# Altium schematic sheet 11.SchDoc
size 635 x 406 mm
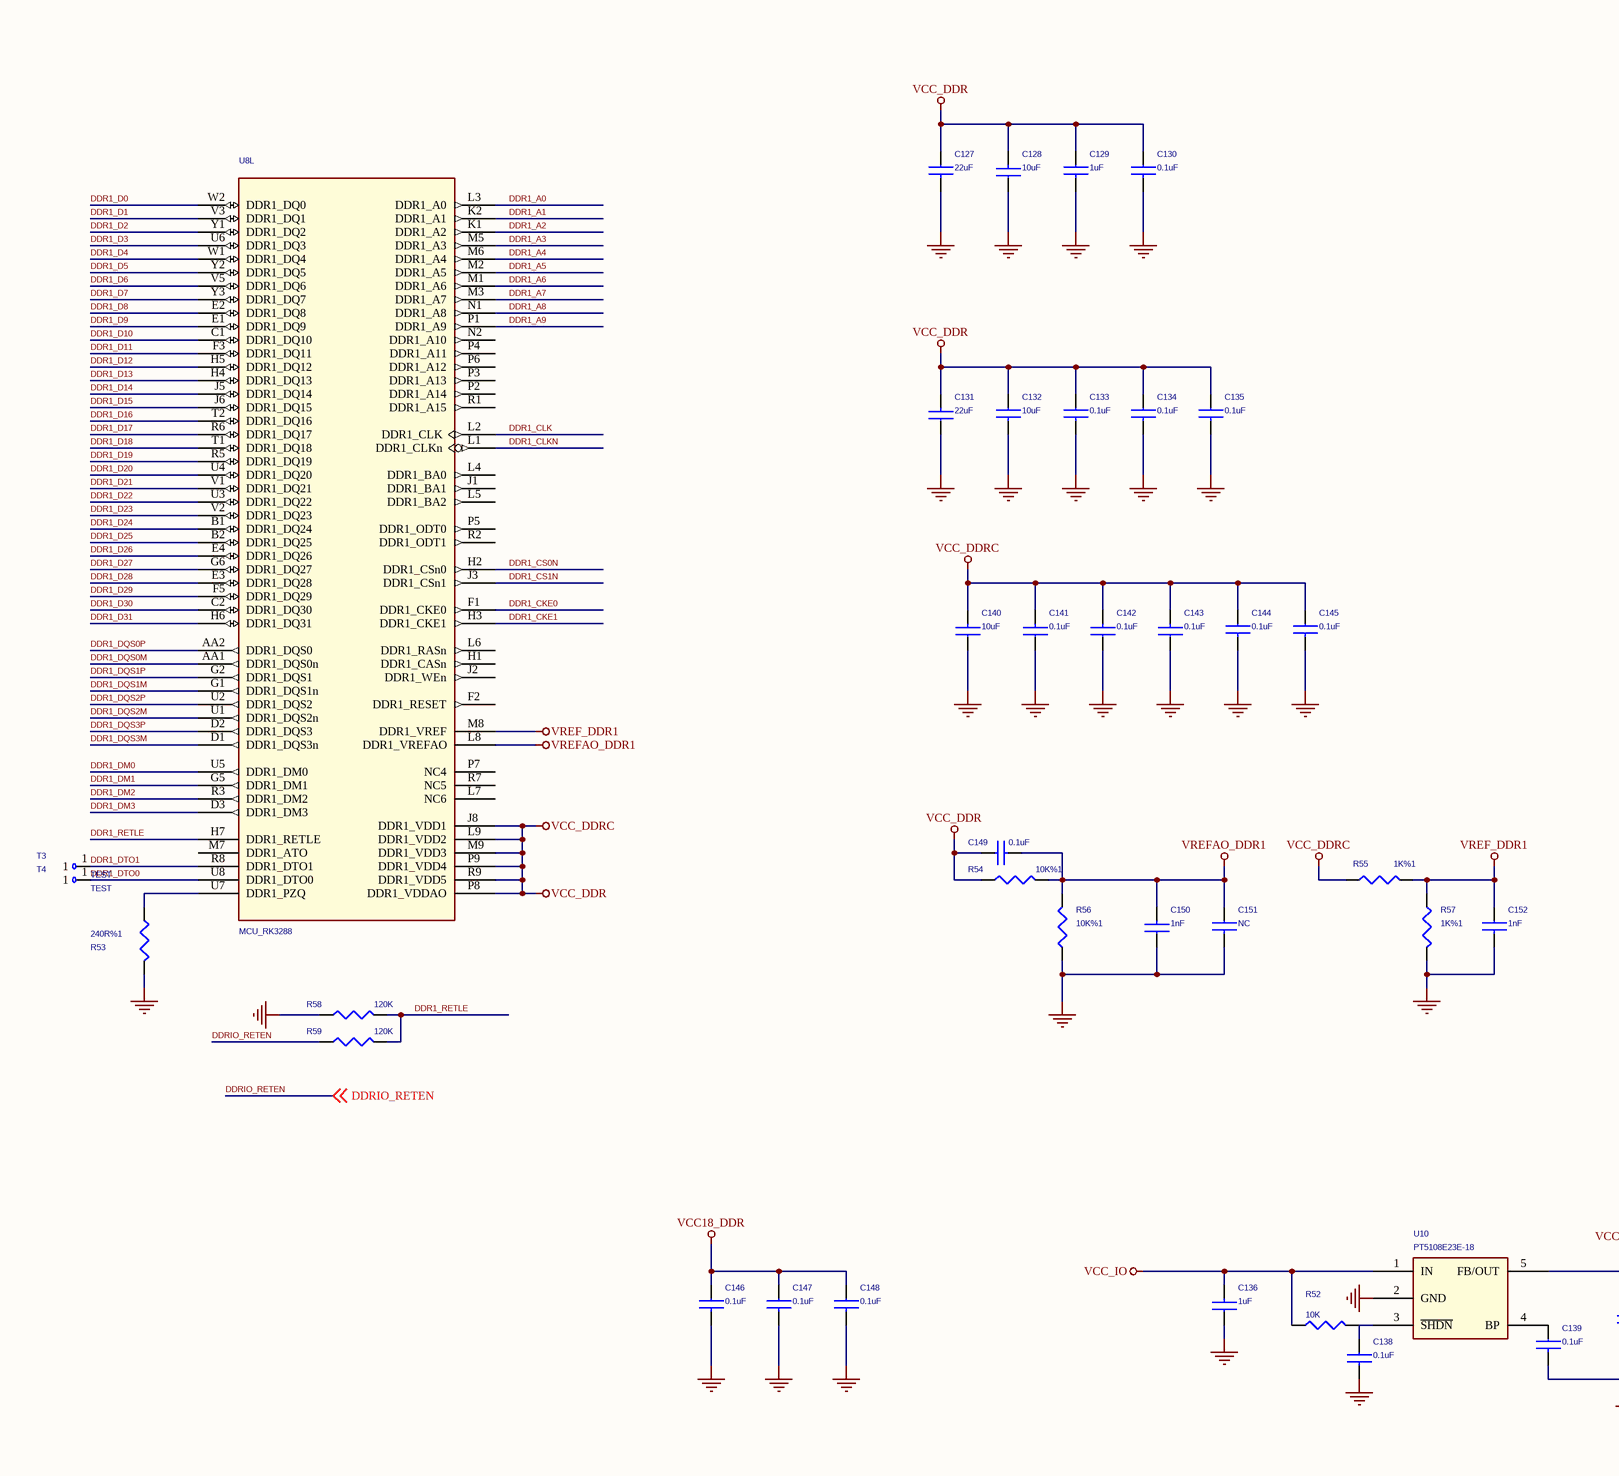
[diagram p0: 11.SchDoc, left]
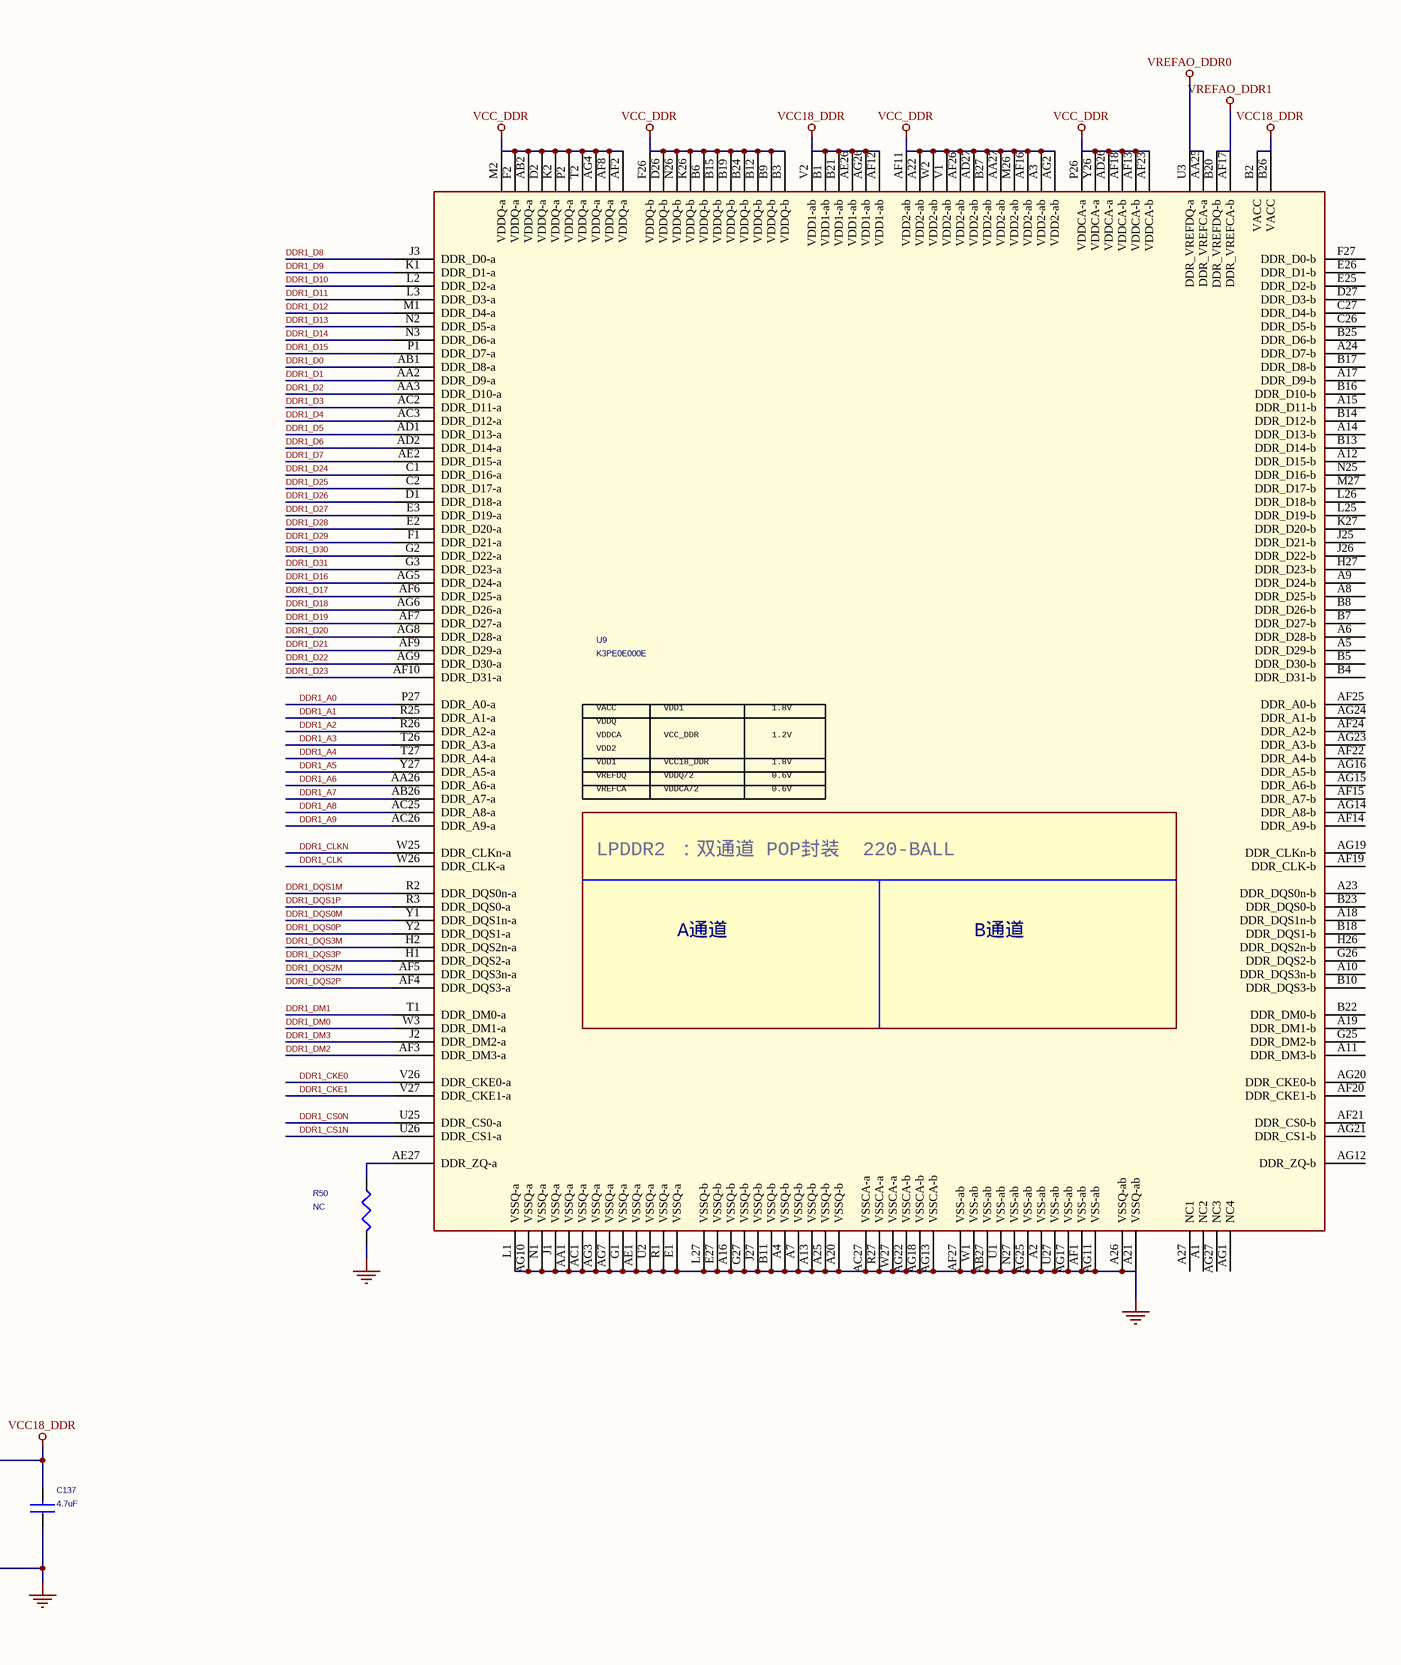
[diagram p1: 11.SchDoc, right]

## Parts
C127  22uF  [C0805]
C128  10uF  [C0603]
C129  1uF  [c0402]
C130  0.1uF  [c0402]
C131  22uF  [C0805]
C132  10uF  [C0603]
C133  0.1uF  [c0402]
C134  0.1uF  [c0402]
C135  0.1uF  [C0201]
C136  1uF  [c0402]
C137  4.7uF  [C0603]
C138  0.1uF  [c0402]
C139  0.1uF  [c0402]
C140  10uF  [C0603]
C141  0.1uF  [c0402]
C142  0.1uF  [c0402]
C143  0.1uF  [c0402]
C144  0.1uF  [c0402]
C145  0.1uF  [c0402]
C146  0.1uF  [c0402]
C147  0.1uF  [c0402]
C148  0.1uF  [C0201]
C149  0.1uF  [c0402]
C150  1nF  [C0201]
C151  NC  [c0402]
C152  1nF  [c0402]
R50  NC  [r0402]
R52  10K  [r0402]
R53  240R%1  [r0402]
R54  10K%1  [r0402]
R55  1K%1  [r0402]
R56  10K%1  [r0402]
R57  1K%1  [r0402]
R58  120K  [r0402]
R59  120K  [r0402]
T3  TEST  [TEST]
T4  TEST  [TEST]
U8  MCU_RK3288  [BGA453-19X19]  (part L of 24)
U9  K3PE0E000E  [FBGA220-14X14]
U10  PT5108E23E-18  [SOT25]

## Nets
GND: C127.2 C128.1 C129.2 C130.2 C131.1 C132.2 C133.2 C134.2 C135.2 C136.1 C137.1 C138.2 C139.2 C140.1 C141.1 C142.1 C143.1 C144.2 C145.2 C146.2 C147.2 C148.2 C150.1 C151.2 C152.2 R50.2 R53.2 R56.1 R57.2 R58.2 U9.A2(VSS-ab) U9.A4(VSSQ-b) U9.A7(VSSQ-b) U9.A13(VSSQ-b) U9.A16(VSSQ-b) U9.A20(VSSQ-b) U9.A21(VSSQ-ab) U9.A25(VSSQ-b) U9.A26(VSSQ-ab) U9.AA1(VSSQ-a) U9.AB27(VSS-ab) U9.AC1(VSSQ-a) U9.AC27(VSSCA-a) U9.AE1(VSSQ-a) U9.AF1(VSS-ab) U9.AF27(VSS-ab) U9.AG3(VSSQ-a) U9.AG7(VSSQ-a) U9.AG10(VSSQ-a) U9.AG11(VSS-ab) U9.AG13(VSSCA-b) U9.AG17(VSS-ab) U9.AG18(VSSCA-b) U9.AG22(VSSCA-b) U9.AG25(VSS-ab) U9.B11(VSSQ-b) U9.E1(VSSQ-a) U9.E27(VSSQ-b) U9.G1(VSSQ-a) U9.G27(VSSQ-b) U9.J1(VSSQ-a) U9.J27(VSSQ-b) U9.L1(VSSQ-a) U9.L27(VSSQ-b) U9.N1(VSSQ-a) U9.N27(VSS-ab) U9.R1(VSSQ-a) U9.R27(VSSCA-a) U9.U1(VSS-ab) U9.U2(VSSQ-a) U9.U27(VSS-ab) U9.W1(VSS-ab) U9.W27(VSSCA-a) U10.2(GND)
VCC18_DDR: C137.2 C146.1 C147.1 C148.1 U9.AE26(VDD1-ab) U9.AF12(VDD1-ab) U9.AG26(VDD1-ab) U9.B1(VDD1-ab) U9.B2(VACC) U9.B21(VDD1-ab) U9.B26(VACC) U9.V2(VDD1-ab) U10.5(FB/OUT)
VCC_DDR: C127.1 C128.2 C129.1 C130.1 C131.2 C132.1 C133.1 C134.1 C135.1 C140.2 C141.2 C142.2 C143.2 C144.1 C145.1 C149.1 R54.1 R55.1 U8.J8(DDR1_VDD1) U8.L9(DDR1_VDD2) U8.M9(DDR1_VDD3) U8.P8(DDR1_VDDAO) U8.P9(DDR1_VDD4) U8.R9(DDR1_VDD5) U9.A3(VDD2-ab) U9.A22(VDD2-ab) U9.AA27(VDD2-ab) U9.AB2(VDDQ-a) U9.AD26(VDDCA-a) U9.AD27(VDD2-ab) U9.AF2(VDDQ-a) U9.AF8(VDDQ-a) U9.AF11(VDD2-ab) U9.AF13(VDDCA-b) U9.AF16(VDD2-ab) U9.AF18(VDDCA-b) U9.AF23(VDDCA-b) U9.AF26(VDD2-ab) U9.AG2(VDD2-ab) U9.AG4(VDDQ-a) U9.B3(VDDQ-b) U9.B6(VDDQ-b) U9.B9(VDDQ-b) U9.B12(VDDQ-b) U9.B15(VDDQ-b) U9.B19(VDDQ-b) U9.B24(VDDQ-b) U9.B27(VDD2-ab) U9.D2(VDDQ-a) U9.D26(VDDQ-b) U9.F2(VDDQ-a) U9.F26(VDDQ-b) U9.K2(VDDQ-a) U9.K26(VDDQ-b) U9.M2(VDDQ-a) U9.M26(VDD2-ab) U9.N26(VDDQ-b) U9.P2(VDDQ-a) U9.P26(VDDCA-a) U9.T2(VDDQ-a) U9.V1(VDD2-ab) U9.W2(VDD2-ab) U9.Y26(VDDCA-a)  [also labelled VCC_DDRC]
VCC_IO: C136.2 R52.1 U10.1(IN)
VREF_DDR1: C152.1 R55.2 R57.1 U8.M8(DDR1_VREF)
VREFAO_DDR0: U9.AA25(DDR_VREFCA-a) U9.U3(DDR_VREFDQ-a)
VREFAO_DDR1: C149.2 C150.2 C151.1 R54.2 R56.2 U8.L8(DDR1_VREFAO) U9.AF17(DDR_VREFCA-b) U9.B20(DDR_VREFDQ-b)
DDR1_A0: U8.L3(DDR1_A0) U9.P27(DDR_A0-a)
DDR1_A1: U8.K2(DDR1_A1) U9.R25(DDR_A1-a)
DDR1_A2: U8.K1(DDR1_A2) U9.R26(DDR_A2-a)
DDR1_A3: U8.M5(DDR1_A3) U9.T26(DDR_A3-a)
DDR1_A4: U8.M6(DDR1_A4) U9.T27(DDR_A4-a)
DDR1_A5: U8.M2(DDR1_A5) U9.Y27(DDR_A5-a)
DDR1_A6: U8.M1(DDR1_A6) U9.AA26(DDR_A6-a)
DDR1_A7: U8.M3(DDR1_A7) U9.AB26(DDR_A7-a)
DDR1_A8: U8.N1(DDR1_A8) U9.AC25(DDR_A8-a)
DDR1_A9: U8.P1(DDR1_A9) U9.AC26(DDR_A9-a)
DDR1_CKE0: U8.F1(DDR1_CKE0) U9.V26(DDR_CKE0-a)
DDR1_CKE1: U8.H3(DDR1_CKE1) U9.V27(DDR_CKE1-a)
DDR1_CLK: U8.L2(DDR1_CLK) U9.W26(DDR_CLK-a)
DDR1_CLKN: U8.L1(DDR1_CLKn) U9.W25(DDR_CLKn-a)
DDR1_CS0N: U8.H2(DDR1_CSn0) U9.U25(DDR_CS0-a)
DDR1_CS1N: U8.J3(DDR1_CSn1) U9.U26(DDR_CS1-a)
DDR1_D0: U8.W2(DDR1_DQ0) U9.AB1(DDR_D8-a)
DDR1_D1: U8.V3(DDR1_DQ1) U9.AA2(DDR_D9-a)
DDR1_D2: U8.Y1(DDR1_DQ2) U9.AA3(DDR_D10-a)
DDR1_D3: U8.U6(DDR1_DQ3) U9.AC2(DDR_D11-a)
DDR1_D4: U8.W1(DDR1_DQ4) U9.AC3(DDR_D12-a)
DDR1_D5: U8.Y2(DDR1_DQ5) U9.AD1(DDR_D13-a)
DDR1_D6: U8.V5(DDR1_DQ6) U9.AD2(DDR_D14-a)
DDR1_D7: U8.Y3(DDR1_DQ7) U9.AE2(DDR_D15-a)
DDR1_D8: U8.E2(DDR1_DQ8) U9.J3(DDR_D0-a)
DDR1_D9: U8.E1(DDR1_DQ9) U9.K1(DDR_D1-a)
DDR1_D10: U8.C1(DDR1_DQ10) U9.L2(DDR_D2-a)
DDR1_D11: U8.F3(DDR1_DQ11) U9.L3(DDR_D3-a)
DDR1_D12: U8.H5(DDR1_DQ12) U9.M1(DDR_D4-a)
DDR1_D13: U8.H4(DDR1_DQ13) U9.N2(DDR_D5-a)
DDR1_D14: U8.J5(DDR1_DQ14) U9.N3(DDR_D6-a)
DDR1_D15: U8.J6(DDR1_DQ15) U9.P1(DDR_D7-a)
DDR1_D16: U8.T2(DDR1_DQ16) U9.AG5(DDR_D24-a)
DDR1_D17: U8.R6(DDR1_DQ17) U9.AF6(DDR_D25-a)
DDR1_D18: U8.T1(DDR1_DQ18) U9.AG6(DDR_D26-a)
DDR1_D19: U8.R5(DDR1_DQ19) U9.AF7(DDR_D27-a)
DDR1_D20: U8.U4(DDR1_DQ20) U9.AG8(DDR_D28-a)
DDR1_D21: U8.V1(DDR1_DQ21) U9.AF9(DDR_D29-a)
DDR1_D22: U8.U3(DDR1_DQ22) U9.AG9(DDR_D30-a)
DDR1_D23: U8.V2(DDR1_DQ23) U9.AF10(DDR_D31-a)
DDR1_D24: U8.B1(DDR1_DQ24) U9.C1(DDR_D16-a)
DDR1_D25: U8.B2(DDR1_DQ25) U9.C2(DDR_D17-a)
DDR1_D26: U8.E4(DDR1_DQ26) U9.D1(DDR_D18-a)
DDR1_D27: U8.G6(DDR1_DQ27) U9.E3(DDR_D19-a)
DDR1_D28: U8.E3(DDR1_DQ28) U9.E2(DDR_D20-a)
DDR1_D29: U8.F5(DDR1_DQ29) U9.F1(DDR_D21-a)
DDR1_D30: U8.C2(DDR1_DQ30) U9.G2(DDR_D22-a)
DDR1_D31: U8.H6(DDR1_DQ31) U9.G3(DDR_D23-a)
DDR1_DM0: U8.U5(DDR1_DM0) U9.W3(DDR_DM1-a)
DDR1_DM1: U8.G5(DDR1_DM1) U9.T1(DDR_DM0-a)
DDR1_DM2: U8.R3(DDR1_DM2) U9.AF3(DDR_DM3-a)
DDR1_DM3: U8.D3(DDR1_DM3) U9.J2(DDR_DM2-a)
DDR1_DQS0M: U8.AA1(DDR1_DQS0n) U9.Y1(DDR_DQS1n-a)
DDR1_DQS0P: U8.AA2(DDR1_DQS0) U9.Y2(DDR_DQS1-a)
DDR1_DQS1M: U8.G1(DDR1_DQS1n) U9.R2(DDR_DQS0n-a)
DDR1_DQS1P: U8.G2(DDR1_DQS1) U9.R3(DDR_DQS0-a)
DDR1_DQS2M: U8.U1(DDR1_DQS2n) U9.AF5(DDR_DQS3n-a)
DDR1_DQS2P: U8.U2(DDR1_DQS2) U9.AF4(DDR_DQS3-a)
DDR1_DQS3M: U8.D1(DDR1_DQS3n) U9.H2(DDR_DQS2n-a)
DDR1_DQS3P: U8.D2(DDR1_DQS3) U9.H1(DDR_DQS2-a)
DDR1_DTO0: T4.1 U8.U8(DDR1_DTO0)
DDR1_DTO1: T3.1 U8.R8(DDR1_DTO1)
DDR1_RETLE: R58.1 R59.1 U8.H7(DDR1_RETLE)
DDRIO_RETEN: R59.2 ; off-sheet DDRIO_RETEN
NetC138_1: C138.1 R52.2 U10.3(~{SHDN})
NetC139_1: C139.1 U10.4(BP)
NetR50_1: R50.1 U9.AE27(DDR_ZQ-a)
NetR53_1: R53.1 U8.U7(DDR1_PZQ)

Not connected (* = marked no-connect by the designer): U8 F2(DDR1_RESET) H1(DDR1_CASn) J1(DDR1_BA1) J2(DDR1_WEn) L4(DDR1_BA0) L5(DDR1_BA2) L6(DDR1_RASn) L7(NC6) M7(DDR1_ATO) N2(DDR1_A10) P2(DDR1_A14) P3(DDR1_A13) P4(DDR1_A11) P5(DDR1_ODT0) P6(DDR1_A12) P7(NC4) R1(DDR1_A15) R2(DDR1_ODT1) R7(NC5); U9 A1(NC2) A5(DDR_D29-b) A6(DDR_D28-b) A8(DDR_D25-b) A9(DDR_D24-b) A10(DDR_DQS3n-b) A11(DDR_DM3-b) A12(DDR_D15-b) A14(DDR_D13-b) A15(DDR_D11-b) A17(DDR_D9-b) A18(DDR_DQS1n-b) A19(DDR_DM1-b) A23(DDR_DQS0n-b) A24(DDR_D7-b) A27(NC1) AF14(DDR_A9-b) AF15(DDR_A7-b) AF19(DDR_CLK-b) AF20(DDR_CKE1-b) AF21(DDR_CS0-b) AF22(DDR_A4-b) AF24(DDR_A2-b) AF25(DDR_A0-b) AG1(NC4) AG12(DDR_ZQ-b) AG14(DDR_A8-b) AG15(DDR_A6-b) AG16(DDR_A5-b) AG19(DDR_CLKn-b) AG20(DDR_CKE0-b) AG21(DDR_CS1-b) AG23(DDR_A3-b) AG24(DDR_A1-b) AG27(NC3) B4(DDR_D31-b) B5(DDR_D30-b) B7(DDR_D27-b) B8(DDR_D26-b) B10(DDR_DQS3-b) B13(DDR_D14-b) B14(DDR_D12-b) B16(DDR_D10-b) B17(DDR_D8-b) B18(DDR_DQS1-b) B22(DDR_DM0-b) B23(DDR_DQS0-b) B25(DDR_D6-b) C26(DDR_D5-b) C27(DDR_D4-b) D27(DDR_D3-b) E25(DDR_D2-b) E26(DDR_D1-b) F27(DDR_D0-b) G25(DDR_DM2-b) G26(DDR_DQS2-b) H26(DDR_DQS2n-b) H27(DDR_D23-b) J25(DDR_D21-b) J26(DDR_D22-b) K27(DDR_D20-b) L25(DDR_D19-b) L26(DDR_D18-b) M27(DDR_D17-b) N25(DDR_D16-b)

## Notes on the sheet
- (near U9) VACC
- (near U9) VDD1
- (near U9) 1.8V
- (near U9) VDDQ
- (near U9) VDDCA
- (near U9) VDD2
- (near U9) VREFDQ
- (near U9) VCC_DDR
- (near U9) VCC18_DDR
- (near U9) VDDQ/2
- (near U9) 1.2V
- (near U9) 0.6V
- (near U9) VREFCA
- (near U9) VDDCA/2
- (in symbol K3PE0E000E_1) LPDDR2 ：双通道 POP封装  220-BALL; A通道; B通道

## Library data of the parts
C127 C129 C130 C132-C135 C144-C152 = CAP NP_0_Dup1
C128 C131 C140-C143 = CAP NP_4
C136 C137 = CAP NP_4: CAP,MLCC,10uF,+/-10%,X5R,6.3V,SMD0805; Supplier: MURATA; Supplier P/N: GRM21BR61C106K
C138 C139 = CAP NP_4: CAP,MLCC,100nF,+/-10%,X7R,6.3V,SMD0402
R50 R52-R59 = RESISTOR_0_Dup1: 贴片电阻
T3 T4 = TEST_0
U8 = MCU_RK3288_3
U9 = K3PE0E000E_1
U10 = DS8008_4: LDO,PT5108E23E-33,VINmax=5.5V,Vout=3.3V,+/-2%,500mA,SOT-23-5